# Altium project DE-250624.PrjPcb
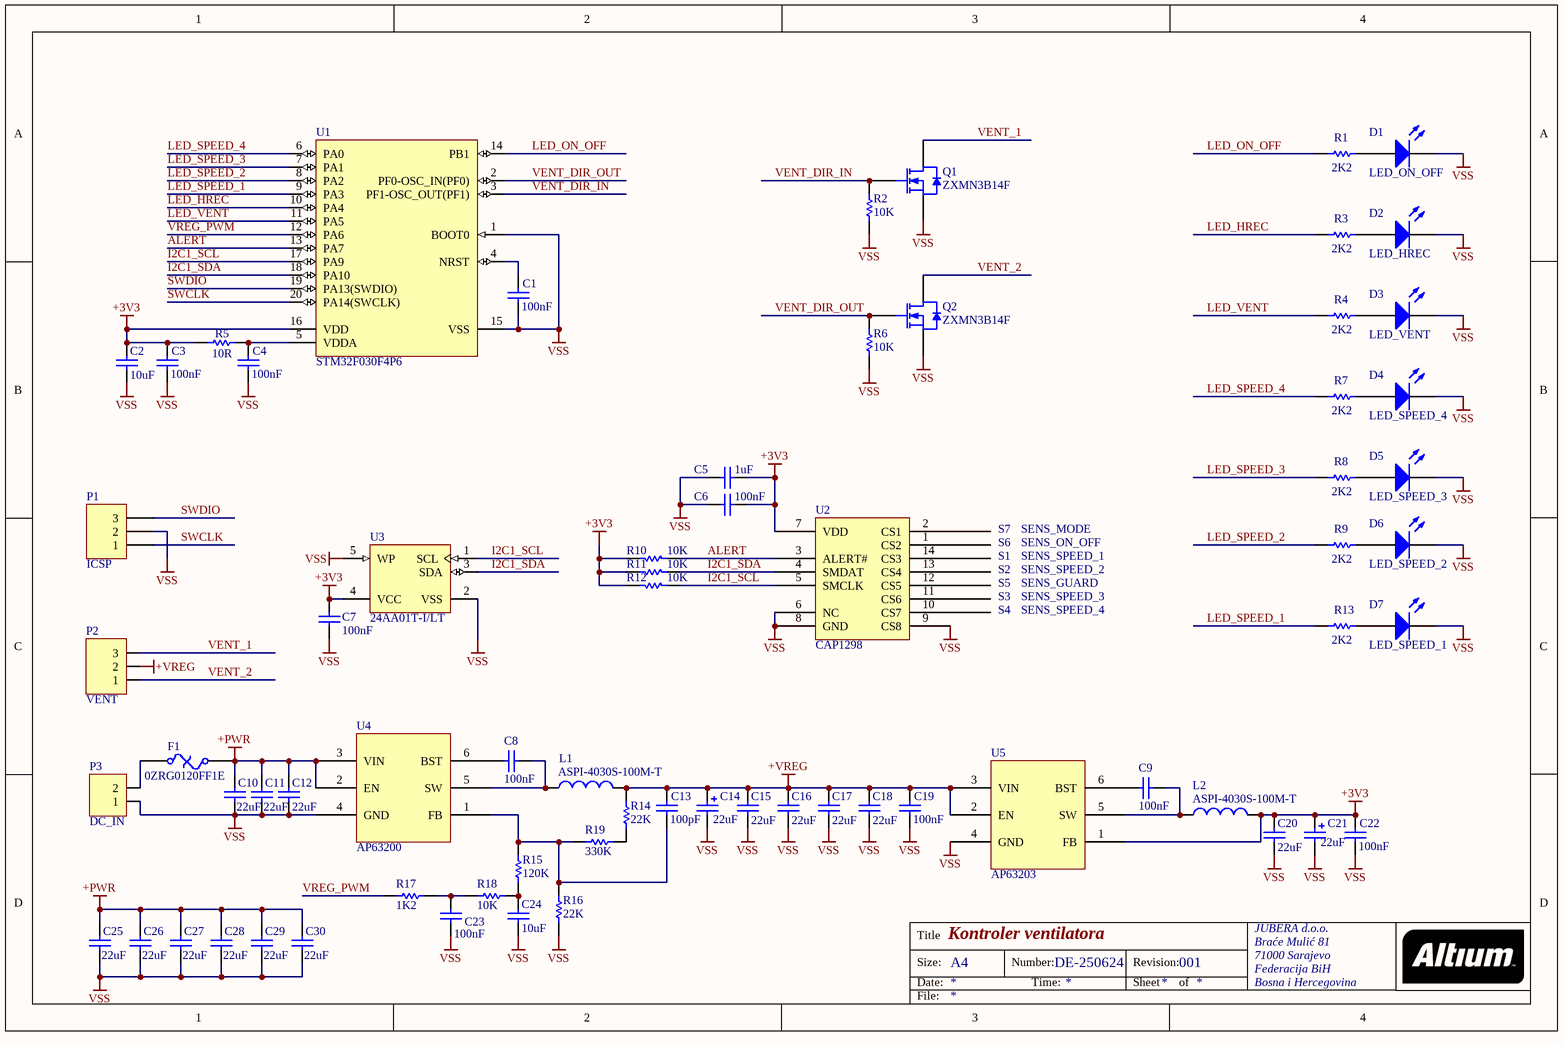
[diagram p0: DE-250624.SchDoc]
1 sheet, 76 parts. Net scope: global (net labels, ports and power ports of the same name join across sheets).
Board file: DE-250624.PcbDoc

## Sheet DE-250624.SchDoc: Kontroler ventilatora
size A4; Author: eldar6776@hotmail.com; DrawnBy: Eldar Dedic; Organization: JUBERA d.o.o.; Address1: Braće Mulić 81; Address2: 71000 Sarajevo; Address3: Federacija BiH; Address4: Bosna i Hercegovina; DocumentNumber: DE-250624; Revision: 001

### Parts
C1  value 100nF  [0603]  (hidden comment: C0603)
C2  value 10uF  [0805]  (hidden comment: C0805)
C3  value 100nF  [0603]  (hidden comment: C0603)
C4  value 100nF  [0603]  (hidden comment: C0603)
C5  value 1uF  [0603]  (hidden comment: C0603)
C6  value 100nF  [0603]  (hidden comment: C0603)
C7  value 100nF  [0603]  (hidden comment: C0603)
C8  100nF  [0603]
C9  100nF  [0603]
C10  value 22uF  [0805]  (hidden comment: C0805)
C11  value 22uF  [0805]  (hidden comment: C0805)
C12  value 22uF  [0805]  (hidden comment: C0805)
C13  value 100pF  [0603]  (hidden comment: C0603)
C14  22uF  [E (8.2 x 4.3 mm)]
C15  value 22uF  [0805]  (hidden comment: C0805)
C16  value 22uF  [0805]  (hidden comment: C0805)
C17  value 22uF  [0805]  (hidden comment: C0805)
C18  value 22uF  [0805]  (hidden comment: C0805)
C19  value 100nF  [0603]  (hidden comment: C0603)
C20  value 22uF  [0805]  (hidden comment: C0805)
C21  22uF  [E (8.2 x 4.3 mm)]
C22  value 100nF  [0603]  (hidden comment: C0603)
C23  value 100nF  [0603]  (hidden comment: C0603)
C24  value 10uF  [0805]  (hidden comment: C0805)
C25  value 22uF  [0805]  (hidden comment: C0805)
C26  value 22uF  [0805]  (hidden comment: C0805)
C27  value 22uF  [0805]  (hidden comment: C0805)
C28  value 22uF  [0805]  (hidden comment: C0805)
C29  value 22uF  [0805]  (hidden comment: C0805)
C30  value 22uF  [0805]  (hidden comment: C0805)
D1  LED_ON_OFF  [LED sa rupom]
D2  LED_HREC  [LED sa rupom]
D3  LED_VENT  [LED sa rupom]
D4  LED_SPEED_4  [LED sa rupom]
D5  LED_SPEED_3  [LED sa rupom]
D6  LED_SPEED_2  [LED sa rupom]
D7  LED_SPEED_1  [LED sa rupom]
F1  0ZRG0120FF1E  [PIN-W2/E2.8]
L1  ASPI-4030S-100M-T  [ASPI-4030S]
L2  ASPI-4030S-100M-T  [ASPI-4030S]
P1  ICSP  [HDR1X3]
P2  VENT  [TERMINAL BLOK 3]
P3  DC_IN  [TERMINAL BLOK 2]
Q1  ZXMN3B14F  [SOT23_N]
Q2  ZXMN3B14F  [SOT23_N]
R1  2K2  [ERA-0603]
R2  10K  [ERA-0603]
R3  2K2  [ERA-0603]
R4  2K2  [ERA-0603]
R5  10R  [ERA-0603]
R6  10K  [ERA-0603]
R7  2K2  [ERA-0603]
R8  2K2  [ERA-0603]
R9  2K2  [ERA-0603]
R10  10K  [ERA-0603]
R11  10K  [ERA-0603]
R12  10K  [ERA-0603]
R13  2K2  [ERA-0603]
R14  22K  [ERA-0603]
R15  120K  [ERA-0603]
R16  22K  [ERA-0603]
R17  1K2  [ERA-0603]
R18  10K  [ERA-0603]
R19  330K  [ERA-0603]
S1  SENS_SPEED_1  [SENSOR_PAD]
S2  SENS_SPEED_2  [SENSOR_PAD]
S3  SENS_SPEED_3  [SENSOR_PAD]
S4  SENS_SPEED_4  [SENSOR_PAD]
S5  SENS_GUARD  [SENSOR_PAD]
S6  SENS_ON_OFF  [SENSOR_PAD]
S7  SENS_MODE  [SENSOR_PAD]
U1  STM32F030F4P6  [STM-TSSOP20_N]
U2  CAP1298  [SOIC14]
U3  24AA01T-I/LT  [SC70-LT5_N]
U4  AP63200  [TSOT-26]
U5  AP63203  [TSOT-26]

### Nets
+3V3: C2.2 C3.2 C5.1 C6.1 C7.1 C20.2 C21.1 C22.2 L2.2 R5.1 R10.2 R11.2 R12.2 U1.16(VDD) U2.7(VDD) U3.4(VCC) U5.1(FB)
+PWR: C10.2 C11.2 C12.2 C25.2 C26.2 C27.2 C28.2 C29.2 C30.2 F1.2 U4.2(EN) U4.3(VIN)
+VREG: C13.2 C14.1 C15.2 C16.2 C17.2 C18.2 C19.2 L1.2 P2.2 R14.1 U5.2(EN) U5.3(VIN)
VSS: C1.1 C2.1 C3.1 C4.1 C5.2 C6.2 C7.2 C10.1 C11.1 C12.1 C14.2 C15.1 C16.1 C17.1 C18.1 C19.1 C20.1 C21.2 C22.1 C23.1 C24.1 C25.1 C26.1 C27.1 C28.1 C29.1 C30.1 D1.2(K) D2.2(K) D3.2(K) D4.2(K) D5.2(K) D6.2(K) D7.2(K) P1.2 P3.1 Q1.2(S) Q2.2(S) R2.1 R6.1 R16.1 U1.1(BOOT0) U1.15(VSS) U2.6(NC) U2.8(GND) U2.9(CS8) U3.2(VSS) U3.5(WP) U4.4(GND) U5.4(GND)
ALERT: R10.1 U1.13(PA7) U2.3(ALERT#)
I2C1_SCL: R12.1 U1.17(PA9) U2.5(SMCLK) U3.1(SCL)
I2C1_SDA: R11.1 U1.18(PA10) U2.4(SMDAT) U3.3(SDA)
LED_HREC: R3.1 U1.10(PA4)
LED_ON_OFF: R1.1 U1.14(PB1)
LED_SPEED_1: R13.1 U1.9(PA3)
LED_SPEED_2: R9.1 U1.8(PA2)
LED_SPEED_3: R8.1 U1.7(PA1)
LED_SPEED_4: R7.1 U1.6(PA0)
LED_VENT: R4.1 U1.11(PA5)
SWCLK: P1.1 U1.20(PA14(SWCLK))
SWDIO: P1.3 U1.19(PA13(SWDIO))
VENT_1: P2.3 Q1.3(D)
VENT_2: P2.1 Q2.3(D)
VENT_DIR_IN: Q1.1(G) R2.2 U1.3(PF1-OSC_OUT(PF1))
VENT_DIR_OUT: Q2.1(G) R6.2 U1.2(PF0-OSC_IN(PF0))
VREG_PWM: R17.1 U1.12(PA6)
NetC1_2: C1.2 U1.4(NRST)
NetC4_2: C4.2 R5.2 U1.5(VDDA)
NetC8_1: C8.1 L1.1 U4.5(SW)
NetC8_2: C8.2 U4.6(BST)
NetC9_1: C9.1 L2.1 U5.5(SW)
NetC9_2: C9.2 U5.6(BST)
NetC13_1: C13.1 R15.1 R16.2 R19.1 U4.1(FB)
NetC23_2: C23.2 R17.2 R18.1
NetC24_2: C24.2 R15.2 R18.2
NetD1_1: D1.1(A) R1.2
NetD2_1: D2.1(A) R3.2
NetD3_1: D3.1(A) R4.2
NetD4_1: D4.1(A) R7.2
NetD5_1: D5.1(A) R8.2
NetD6_1: D6.1(A) R9.2
NetD7_1: D7.1(A) R13.2
NetF1_1: F1.1 P3.2
NetR14_2: R14.2 R19.2
NetS1_1: S1.1 U2.14(CS3)
NetS2_1: S2.1 U2.13(CS4)
NetS3_1: S3.1 U2.11(CS6)
NetS4_1: S4.1 U2.10(CS7)
NetS5_1: S5.1 U2.12(CS5)
NetS6_1: S6.1 U2.1(CS2)
NetS7_1: S7.1 U2.2(CS1)

### Notes on the sheet
- Title
- Size:
- Date:
- A4
- Number:
- Time:
- Revision:
- Sheet
- of
- File:

### Library data of the parts
C1 C3-C9 C13 C19 C22 C23 = C0603: Ceramic Chip Capacitor - 25V; Note: Footprint corresponds to dimensions for bulk cassette packaging. This case size has tightened tolerances.; Published: 17-Jul-2002; LatestRevisionDate: 19-Mar-2004; LatestRevisionNote: Silkscreen size reduced.; DatasheetDocument: Mar-2001; PackageDocument: Mar-2001; PackageReference: 0603; Publisher: Altium Limited; Code_JEITA: 0603; Code_IPC: 1608 [0603]; ComponentLink1Description: Manufacturer Link; ComponentLink1URL: http://www.kemet.com/; ComponentLink2Description: Datasheet; ComponentLink2URL: http://www.kemet.com/kemet/web/homepage/kechome.nsf/vapubfilesname/F3102TA.pdf/$file/F3102TA.pdf
  C8 C9: Value: 100nF
C2 C15-C18 C20 C24 = C0805: Ceramic Chip Capacitor - 25V; Note: Footprint corresponds to dimensions for bulk cassette packaging. This case size has tightened tolerances.; Published: 17-Jul-2002; LatestRevisionDate: 19-Mar-2004; LatestRevisionNote: Silkscreen size reduced.; DatasheetDocument: Mar-2001; PackageDocument: Mar-2001; PackageReference: 0805; Publisher: Altium Limited; Code_JEITA: 0805; Code_IPC: 2012[0805]; ComponentLink1Description: Manufacturer Link; ComponentLink1URL: http://www.kemet.com/; ComponentLink2Description: Datasheet; ComponentLink2URL: http://www.kemet.com/kemet/web/homepage/kechome.nsf/vapubfilesname/F3102TA.pdf/$file/F3102TA.pdf
C10 C12 C25-C30 = C0805: Ceramic Chip Capacitor - 35V; Note: Footprint corresponds to dimensions for bulk cassette packaging. This case size has tightened tolerances.; Published: 17-Jul-2002; LatestRevisionDate: 19-Mar-2004; LatestRevisionNote: Silkscreen size reduced.; DatasheetDocument: Mar-2001; PackageDocument: Mar-2001; PackageReference: 0805; Publisher: Altium Limited; Code_JEITA: 0805; Code_IPC: 2012[0805]; ComponentLink1Description: Manufacturer Link; ComponentLink1URL: http://www.kemet.com/; ComponentLink2Description: Datasheet; ComponentLink2URL: http://www.kemet.com/kemet/web/homepage/kechome.nsf/vapubfilesname/F3102TA.pdf/$file/F3102TA.pdf
C11 = C0805: Ceramic Chip Capacitor -  35V; Note: Footprint corresponds to dimensions for bulk cassette packaging. This case size has tightened tolerances.; Published: 17-Jul-2002; LatestRevisionDate: 19-Mar-2004; LatestRevisionNote: Silkscreen size reduced.; DatasheetDocument: Mar-2001; PackageDocument: Mar-2001; PackageReference: 0805; Publisher: Altium Limited; Code_JEITA: 0805; Code_IPC: 2012[0805]; ComponentLink1Description: Manufacturer Link; ComponentLink1URL: http://www.kemet.com/; ComponentLink2Description: Datasheet; ComponentLink2URL: http://www.kemet.com/kemet/web/homepage/kechome.nsf/vapubfilesname/F3102TA.pdf/$file/F3102TA.pdf
C14 C21 = TMCME1E226 TRF: Tantalum Chip Capacitor: 22uF  25VDC; Note: See Data Sheet for full range of components; Published: 19-Mar-2004; DatasheetDocument: 05-Jul-2002; PackageReference: E; Publisher: Altium Limited; ComponentLink1Description: Manufacturer Link; ComponentLink1URL: http://www.vishay.com/; Value: 22uF
D1 D4-D7 = HSMC-C540-F0001: Avago HSMW-C265; LuminousIntensity: 96mcd (Minimum).; LED_Colour: Red; PCB_Layout: Complies with manufacturer's recommendation.; Published: 11-Dec-2002; DatasheetDocument: 7-Mar-2002; PackageDocument: 30-Apr-2002; PackageReference: 2.0X1.25X1.2; Publisher: Altium Limited; ComponentLink1Description: Manufacturer Link; ComponentLink1URL: http://www.agilent.com/; ComponentLink2Description: Datasheet; ComponentLink2URL: http://cp.literature.agilent.com/litweb/pdf/5988-5794EN.pdf
D2 = HSMC-C540-F0001: Avago HSML-C265; LuminousIntensity: 96mcd (Minimum).; LED_Colour: Red; PCB_Layout: Complies with manufacturer's recommendation.; Published: 11-Dec-2002; DatasheetDocument: 7-Mar-2002; PackageDocument: 30-Apr-2002; PackageReference: 2.0X1.25X1.2; Publisher: Altium Limited; ComponentLink1Description: Manufacturer Link; ComponentLink1URL: http://www.agilent.com/; ComponentLink2Description: Datasheet; ComponentLink2URL: http://cp.literature.agilent.com/litweb/pdf/5988-5794EN.pdf
D3 = HSMC-C540-F0001: Avago HSMR-C265; LuminousIntensity: 96mcd (Minimum).; LED_Colour: Red; PCB_Layout: Complies with manufacturer's recommendation.; Published: 11-Dec-2002; DatasheetDocument: 7-Mar-2002; PackageDocument: 30-Apr-2002; PackageReference: 2.0X1.25X1.2; Publisher: Altium Limited; ComponentLink1Description: Manufacturer Link; ComponentLink1URL: http://www.agilent.com/; ComponentLink2Description: Datasheet; ComponentLink2URL: http://cp.literature.agilent.com/litweb/pdf/5988-5794EN.pdf
F1 = Fuse Thermal: 30 VDC 2 A Resettable Fuse - PPTC; Published: 24-Mar-1999; LatestRevisionDate: 17-Jul-2002; LatestRevisionNote: Re-released for DXP Platform.; PackageReference: PIN-W2/E2.8; Publisher: Altium Limited; PackageDescription: Thru-Hole; 2 Leads
L1 L2 = ASPI-4030S: Wire Wound Magnetically Shielded SMD Power Inductor; Code_IEC: 1005; Published: 8-Jun-2000; LatestRevisionDate: 29-May-2009; LatestRevisionNote: IPC-7351 Footprint Added.; PackageReference: 0402-A; Publisher: Altium Limited; PackageDescription: Chip Inductor; Code_JEITA: 0402
P1 = Header 3: Header, 3-Pin; LatestRevisionDate: 17-Jul-2002; LatestRevisionNote: Re-released for DXP Platform.; Publisher: Altium Limited
P2 = TERMINAL BLOK 3: 3 pinski terminal blok konektor
P3 = TERMINAL BLOK 2: Terminal blok konektor 3,5 mm
Q1 Q2 = BSS123: N-channel Enhancement Mode Vertical D-MOSFET; Published: 17-Sep-2003; LatestRevisionDate: 12-Dec-2006; LatestRevisionNote: IPC-7351 Footprint Added.; DatasheetVersion: Apr-1995; PackageVersion: May-1999; PackageReference: SOT23; Publisher: Altium Limited; PackageDescription: 3-Pin SOT-23 Package 0.95 mm Pitch, 2.3 mm Lead Span; ComponentLink1Description: Manufacturer Link; ComponentLink1URL: http://www.semiconductors.philips.com/; ComponentLink2Description: Datasheet; ComponentLink2URL: http://www.semiconductors.philips.com/acrobat/datasheets/BSS123_3.pdf
R1-R19 = ERAV: Metal Film Thermosensitive Chip Resistor, 0.56 Ohm to 10k Ohm Range, 5% Tolerance, 0603 Size, 0.063 W; Note: If flow soldering, adjust pad width of PCB Footprint to 0.7 - 0.8 times the width of the resistor.; Published: 17-Dec-2003; LatestRevisionDate: 19-Mar-2004; LatestRevisionNote: Silkscreen size reduced.; PackageDocument: Mar-2003; PackageReference: ERA-0603; Publisher: Altium Limited; Code_IPC: 1608 [0603]; ComponentLink1Description: Manufacturer Link; ComponentLink1URL: http://www.panasonic.com/industrial/components/resistive_products.htm; ComponentLink2Description: Datasheet; ComponentLink2URL: http://www.panasonic.com/industrial/components/pdf/AOF0000CE1.pdf
S1-S7 = Touch sensor
U1 = STM32F030F4P6: ARM Cortex-M0 32-bit MCU, 16 KB Flash, 4 KB Internal RAM, 15 I/Os, 20-pin TSSOP, -40 to 85 degC, Tube; FLASH Size (Prog) (kB): 16; I/Os (High Current): 15; Internal RAM Size (kB): 4; Operating Frequency(F) (Processor speed) (MHz): 48; Supply Voltage(Vcc) min (V): 2.4; DatasheetVersion: Rev. 1; PackageVersion: Rev. 1, 11/2012; PackageReference: TSSOP20; PackageDescription: 20-Pin Thin Shrink Small Outline Package, 6.5 x 4.4 mm Body, 0.65 mm Pitch; Supplier 1: Digi-Key; Supplier Part Number 1: 497-14044-5-ND; Supplier 2: Newark; Supplier Part Number 2: 06X3648; Supplier 3: Mouser; Supplier Part Number 3: 511-STM32F030F4P6; Core: ARM Cortex-M0; Packing: Tube; Mounting Technology: Surface Mount; PartNumber: STM32F030F4P6; ComponentLink1Description: Manufacturer URL; ComponentLink1URL: http://www.st.com/web/en/home.html; ComponentLink2Description: Datasheet; ComponentLink2URL: http://www.st.com/st-web-ui/static/active/en/resource/technical/document/datasheet/DM00088500.pdf; ComponentLink3Description: Package Specification; ComponentLink3URL: http://www.st.com/st-web-ui/static/active/en/resource/technical/document/datasheet/DM00065136.pdf
U2 = CAP1298: 8 chanel capacitive sensor ic; Published: 8-Jun-2000; LatestRevisionDate: 13-Apr-2006; LatestRevisionNote: IPC-7351 Footprint Added.; DatasheetVersion: May-1997; PackageVersion: Jan-1998; PackageReference: D016; Publisher: Altium Limited; PackageDescription: 16-Pin Small Outline Integrated Circuit 1.27 mm Pitch; Code_IPC: SOIC127P600-16; ComponentLink1Description: Manufacturer Link; ComponentLink1URL: http://www.ti.com/; ComponentLink2Description: Datasheet; ComponentLink2URL: http://www-s.ti.com/sc/ds/sn74hc595.pdf
U3 = 24LC01BHT-I/LT: 1Kbit, 400kHz, 2.5V, I2C Serial EEPROM, 5-Pin SC70, Industrial Temperature, Tape and Reel; Published: 2-Dec-2009; DatasheetVersion: revA, Sep-2008; PackageVersion: revBB, Aug-2009; PackageReference: SC70-LT5; Publisher: Altium Limited; PackageDescription: 5-Lead Plastic Small Outline Transistor (LT) [SC70]; Supplier 1: Digi-Key; Supplier Part Number 1: 24LC01BHT-I/LTTR-ND; Supplier 2: Digi-Key; Supplier Part Number 2: 24LC01BHT-I/LTCT-ND; Supplier 3: Digi-Key; Supplier Part Number 3: 24LC01BHT-I/LTDKR-ND; Code_IPC: SOT353-5; ComponentLink1Description: Datasheet; ComponentLink1URL: http://ww1.microchip.com/downloads/en/DeviceDoc/22104A.pdf; ComponentLink2Description: Packaging Specification; ComponentLink2URL: http://www.microchip.com/stellent/groups/techpub_sg/documents/packagingspec/en012702.pdf; ComponentLink3Description: Microchip.com Home; ComponentLink3URL: http://www.microchip.com/
U4 U5 = AP63200: 2A synchronous  buck converter